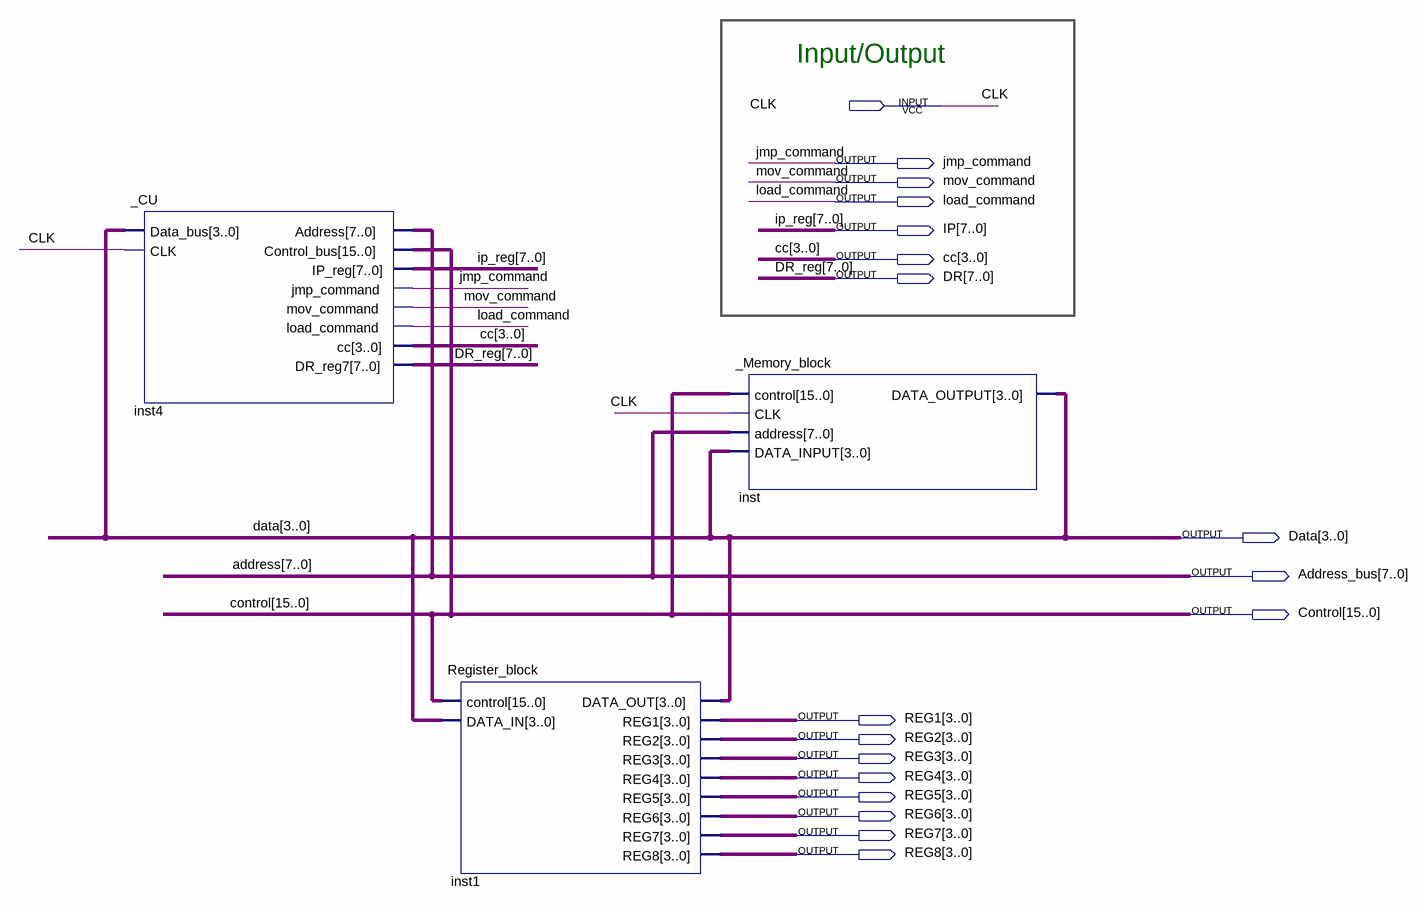
[diagram p0: schematic sheet]
// Quartus schematic _main.bdf as structural Verilog: 3 symbols, 18 pins
module _main (
  input  CLK,
  output jmp_command,
  output mov_command,
  output load_command,
  output [7:0] IP,
  output [3:0] cc,
  output [7:0] DR,
  output [3:0] Data,
  output [7:0] Address_bus,
  output [15:0] Control,
  output [3:0] REG1,
  output [3:0] REG2,
  output [3:0] REG3,
  output [3:0] REG4,
  output [3:0] REG5,
  output [3:0] REG6,
  output [3:0] REG7,
  output [3:0] REG8
);

  _CU inst4 (
    .Data_bus(Data), .CLK(CLK), .Address(Address_bus), .Control_bus(Control), .IP_reg(IP),
    .jmp_command(jmp_command), .mov_command(mov_command), .load_command(load_command), .cc(cc), .DR_reg7(DR));
  Register_block inst1 (
    .control(Control), .DATA_IN(Data), .DATA_OUT(Data), .REG1(REG1), .REG2(REG2), .REG3(REG3), .REG4(REG4),
    .REG5(REG5), .REG6(REG6), .REG7(REG7), .REG8(REG8));
  _Memory_block inst (.control(Control), .CLK(CLK), .address(Address_bus), .DATA_INPUT(Data), .DATA_OUTPUT(Data));

  // Other names for the same wires on the sheet: address[7:0] = Address_bus; DR_reg[7:0] = DR; ip_reg[7:0] = IP

  // Notes on the sheet:
  //   Input/Output
endmodule
